# Altium schematic sheet USB.SchDoc
size A4; SheetNumber: 12; SheetTotal: 13
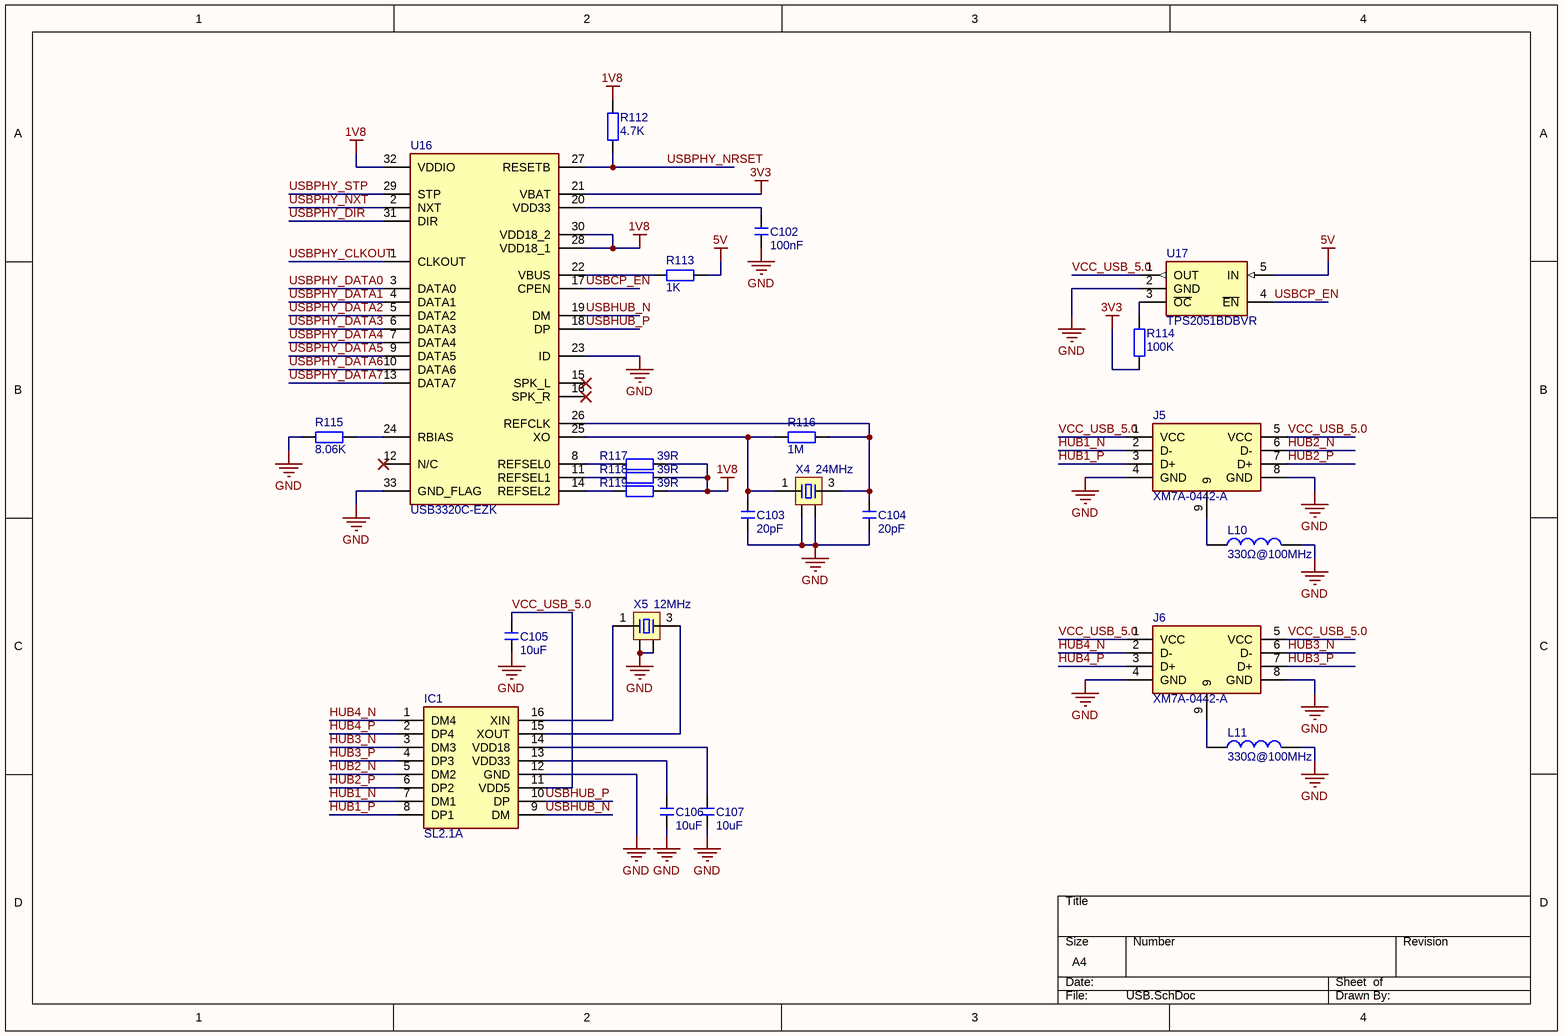
[diagram p0: USB.SchDoc]

## Parts
C102  100nF  [C 0402_L]
C103  20pF  [C 0805_L]
C104  20pF  [C 0805_L]
C105  10uF  [C 0603_L]
C106  10uF  [C 0603_L]
C107  10uF  [C 0603_L]
IC1  SL2.1A  [SOP16N_L]
J5  XM7A-0442-A  [XM7A0442A]
J6  XM7A-0442-A  [XM7A0442A]
L10  330Ω@100MHz  [L 0805]
L11  330Ω@100MHz  [L 0805]
R112  4.7K  [R 0402_L]
R113  1K  [R 0402_L]
R114  100K  [R 0805_L]
R115  8.06K  [R 0402_L]
R116  1M  [R 0402_L]
R117  39R  [R 0805_L]
R118  39R  [R 0805_L]
R119  39R  [R 0805_L]
U16  USB3320C-EZK  [QFN32 5x5_M]
U17  TPS2051BDBVR  [SOT23-5N]
X4  24MHz  [OSC 1612-4P]
X5  12MHz  [OSC 1612-4P]

## Nets
1V8: R112.2 R117.1 R118.1 R119.1 U16.28(VDD18_1) U16.30(VDD18_2) U16.32(VDDIO)
3V3: R114.1 U16.21(VBAT)
5V: R113.1 U17.5(IN)
GND: C102.1 C103.1 C104.1 C105.1 C106.1 C107.1 IC1.12(GND) J5.4(GND) J5.8(GND) J6.4(GND) J6.8(GND) L10.2 L11.2 R115.1 U16.23(ID) U16.33(GND_FLAG) U17.2(GND) X4.2 X4.4 X5.2 X5.4
HUB1_N: IC1.7(DM1) J5.2(D-)
HUB1_P: IC1.8(DP1) J5.3(D+)
HUB2_N: IC1.5(DM2) J5.6(D-)
HUB2_P: IC1.6(DP2) J5.7(D+)
HUB3_N: IC1.3(DM3) J6.6(D-)
HUB3_P: IC1.4(DP3) J6.7(D+)
HUB4_N: IC1.1(DM4) J6.2(D-)
HUB4_P: IC1.2(DP4) J6.3(D+)
USBCP_EN: U16.17(CPEN) U17.4(~{EN})
USBHUB_N: IC1.9(DM) U16.19(DM)
USBHUB_P: IC1.10(DP) U16.18(DP)
USBPHY_CLKOUT: U16.1(CLKOUT)
USBPHY_DATA0: U16.3(DATA0)
USBPHY_DATA1: U16.4(DATA1)
USBPHY_DATA2: U16.5(DATA2)
USBPHY_DATA3: U16.6(DATA3)
USBPHY_DATA4: U16.7(DATA4)
USBPHY_DATA5: U16.9(DATA5)
USBPHY_DATA6: U16.10(DATA6)
USBPHY_DATA7: U16.13(DATA7)
USBPHY_DIR: U16.31(DIR)
USBPHY_NRSET: R112.1 U16.27(RESETB)
USBPHY_NXT: U16.2(NXT)
USBPHY_STP: U16.29(STP)
VCC_USB_5.0: C105.2 IC1.11(VDD5) J5.1(VCC) J5.5(VCC) J6.1(VCC) J6.5(VCC) U17.1(OUT)
NetC102_2: C102.2 U16.20(VDD33)
NetC103_2: C103.2 R116.1 U16.25(XO) X4.1
NetC104_2: C104.2 R116.2 U16.26(REFCLK) X4.3
NetC106_2: C106.2 IC1.13(VDD33)
NetC107_2: C107.2 IC1.14(VDD18)
NetIC1_15: IC1.15(XOUT) X5.3
NetIC1_16: IC1.16(XIN) X5.1
NetJ5_9: J5.9 L10.1
NetJ6_9: J6.9 L11.1
NetR113_2: R113.2 U16.22(VBUS)
NetR114_2: R114.2 U17.3(~{OC})
NetR115_2: R115.2 U16.24(RBIAS)
NetR117_2: R117.2 U16.8(REFSEL0)
NetR118_2: R118.2 U16.11(REFSEL1)
NetR119_2: R119.2 U16.14(REFSEL2)

Not connected (* = marked no-connect by the designer): U16 12(N/C)* 15(SPK_L)* 16(SPK_R)*

## Library data of the parts
C102-C107 = C: 无极性贴片电容; 版权归属: 源创客; BOM名称: 无极性贴片电容; 学习资源: www.ooocke.com
IC1 = SL2.1A: Integrated Circuit; Manufacturer_Name: CoreChips ShenZhen CO.,Ltd; Datasheet Link: https://datasheet.lcsc.com/szlcsc/1811151645_CoreChips-SL2-1A_C192893.pdf; Height: 1.85mm; Manufacturer_Part_Number: SL2.1A
J5 J6 = XM7A-0442-A: USB2.0-A双层; Manufacturer_Name: Omron Electronics; Datasheet Link: https://www.arrow.com/en/products/xm7a-0442-a/omron; Height: 15.62mm; Manufacturer_Part_Number: XM7A-0442-A; Mouser Part Number: 653-XM7A-0442A; Mouser Price/Stock: https://www.mouser.co.uk/ProductDetail/Omron-Electronics/XM7A-0442-A?qs=RJLCOMRfwh3EnMRCxNWGgg%3D%3D; Arrow Part Number: XM7A-0442-A; Arrow Price/Stock: https://www.arrow.com/en/products/xm7a-0442-a/omron
L10 L11 = L: 小功率贴片电感; 版权归属: 源创客; BOM名称: 小功率贴片电感; 学习资源: www.ooocke.com
R112-R119 = R: 贴片电阻; 版权归属: 源创客; BOM名称: 贴片电阻; 学习资源: www.ooocke.com
U16 = USB3320C-EZK: USB集线芯片; Manufacturer_Name: Microchip; Datasheet Link: https://componentsearchengine.com/Datasheets/2/USB3320C-EZK.pdf; Height: 1mm; Manufacturer_Part_Number: USB3320C-EZK; Mouser Part Number: 886-USB3320C-EZK; Mouser Price/Stock: https://www.mouser.co.uk/ProductDetail/Microchip-Technology-Atmel/USB3320C-EZK?qs=pA5MXup5wxEV58aAJyVneA%3D%3D; Arrow Part Number: USB3320C-EZK; Arrow Price/Stock: https://www.arrow.com/en/products/usb3320c-ezk/microchip-technology?region=nac
U17 = TPS2051BDBVR: 模拟开关芯片; Manufacturer_Name: Texas Instruments; Datasheet Link: http://www.ti.com/lit/ds/symlink/tps2051b.pdf; Height: 1.45mm; Manufacturer_Part_Number: TPS2051BDBVR; Mouser Part Number: 595-TPS2051BDBVR; Mouser Price/Stock: https://www.mouser.co.uk/ProductDetail/Texas-Instruments/TPS2051BDBVR?qs=7kv20MEVUljVx%2Fqc0C%252Bidw%3D%3D; Arrow Part Number: TPS2051BDBVR; Arrow Price/Stock: https://www.arrow.com/en/products/tps2051bdbvr/texas-instruments?region=nac
X4 X5 = XTAL-4P: 4脚无源晶振; 版权归属: 源创客; BOM名称: 4脚无源晶振; 学习资源: www.ooocke.com